# Altium schematic sheet THB.SchDoc
size A4
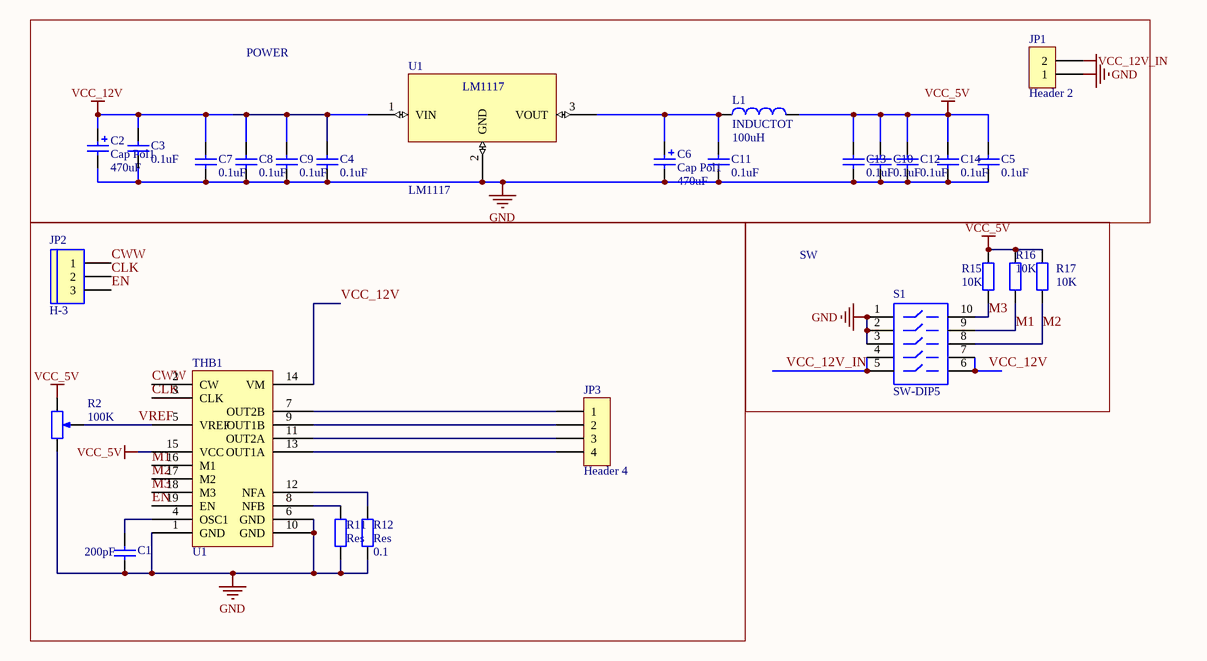
[diagram p0: THB.SchDoc]

## Parts
C1  value 200pF  [CC1005-0402]  (hidden comment: CAP)
C2  Cap Pol1  value 470uF  [diode stan]
C3  value 0.1uF  [CC1005-0402]  (hidden comment: CAP_1)
C4  value 0.1uF  [CC1005-0402]  (hidden comment: CAP)
C5  value 0.1uF  [CC1005-0402]  (hidden comment: CAP)
C6  Cap Pol1  value 470uF  [diode stan]
C7  value 0.1uF  [CC1005-0402]  (hidden comment: CAP_1)
C8  value 0.1uF  [CC1005-0402]  (hidden comment: CAP_1)
C9  value 0.1uF  [CC1005-0402]  (hidden comment: CAP_1)
C10  value 0.1uF  [CC1005-0402]  (hidden comment: CAP_1)
C11  value 0.1uF  [CC1005-0402]  (hidden comment: CAP_1)
C12  value 0.1uF  [CC1005-0402]  (hidden comment: CAP_1)
C13  value 0.1uF  [CC1005-0402]  (hidden comment: CAP_1)
C14  value 0.1uF  [CC1005-0402]  (hidden comment: CAP_1)
JP1  Header 2  [HDR1-2]
JP2  H-3  [H- 3]
JP3  Header 4  [HDR1-4]
L1  INDUCTOT  value 100uH  [贴片电感]
R2  value 100K  [res-adj-tiepian]  (hidden comment: RES-Pot2)
R11  Res  [AXLAL0.4]
R12  Res  value 0.1  [AXLAL0.4]
R15  value 10K  [R2012-0805]  (hidden comment: Res)
R16  value 10K  [R2012-0805]  (hidden comment: Res)
R17  value 10K  [R2012-0805]  (hidden comment: Res)
S1  SW-DIP5  [SW-5]
THB1  U1  [THB7218]
U1  LM1117  [DSO-G3/P2.3]

## Blocks framed on the sheet
POWER: C2-C14 JP1 L1 U1
SW: R15-R17 S1

## Nets
GND: C1.1 C2.2 C3.1 C4.1 C5.1 C6.2 C7.1 C8.1 C9.1 C10.1 C11.1 C12.1 C13.1 C14.1 JP1.1 R2.3(TOP) R11.1 R12.1 S1.1 S1.2 S1.3 THB1.1(GND) THB1.6(GND) THB1.10(GND) U1.2(GND)
VCC_5V: C5.2 C10.2 C12.2 C13.2 C14.2 L1.2 R2.1(BOT) R15.2 R16.2 R17.2 THB1.15(VCC)
VCC_12V: C2.1 C3.2 C4.2 C7.2 C8.2 C9.2 S1.6 S1.7 THB1.14(VM) U1.1(VIN)
VCC_12V_IN: JP1.2 S1.4 S1.5
CLK: JP2.2 THB1.3(CLK)
CWW: JP2.1 THB1.2(CW)
EN: JP2.3 THB1.19(EN)
M1: R16.1 S1.9 THB1.16(M1)
M2: R17.1 S1.8 THB1.17(M2)
M3: R15.1 S1.10 THB1.18(M3)
VREF: R2.2(TAP) THB1.5(VREF)
NetC1_2: C1.2 THB1.4(OSC1)
NetC6_1: C6.1 C11.2 L1.1 U1.3(VOUT)
NetJP3_1: JP3.1 THB1.7(OUT2B)
NetJP3_2: JP3.2 THB1.9(OUT1B)
NetJP3_3: JP3.3 THB1.11(OUT2A)
NetJP3_4: JP3.4 THB1.13(OUT1A)
NetR11_2: R11.2 THB1.8(NFB)
NetR12_2: R12.2 THB1.12(NFA)

## Library data of the parts
C1 C4 C5 = CAP: Capacitor; Manufacturer: Generic Components; Class: Passive; Published: 08/06/2000; Publisher: Altium Hobart Technology Centre; SubClass: Capacitor
C2 C6 = Cap Pol1: Polarized Capacitor (Radial); Manufacturer: Generic Components; Class: Passive; Published: 08/06/2000; Publisher: Altium Hobart Technology Centre; SubClass: Capacitor
C3 C7-C14 = CAP_1: Capacitor; Manufacturer: Generic Components; Class: Passive; Published: 08/06/2000; Publisher: Altium Hobart Technology Centre; SubClass: Capacitor
JP1 = Header 2: Header, 2-Pin; Manufacturer: Generic Components; Class: Connector
JP2 = H-3: Header, 3-Pin; Manufacturer: Generic Components; Class: Connector
JP3 = Header 4: Header, 4-Pin; Manufacturer: Generic Components; Class: Connector
L1 = INDUCTOT: Inductor; Manufacturer: Generic Components; Class: Passive; Published: 08/06/2000; Publisher: Altium Hobart Technology Centre; SubClass: Inductor
R2 = RES-Pot2: Potentiometer; Class: Passive; SubClass: Potentiometer
R11 = Res: Resistor; Manufacturer: Generic Components; Class: Passive; Value: 0.1; Published: 08/06/2000; Publisher: Altium Hobart Technology Centre; SubClass: Resistor
R12 R15-R17 = Res: Resistor; Manufacturer: Generic Components; Class: Passive; Published: 08/06/2000; Publisher: Altium Hobart Technology Centre; SubClass: Resistor
S1 = SW-DIP5: DIP Switch,5-bit; Manufacturer: Generic Components; Published: 1999
THB1 = THB7128